# EAGLE design sgtl5000_breakout_board (EAGLE 9.6.2)
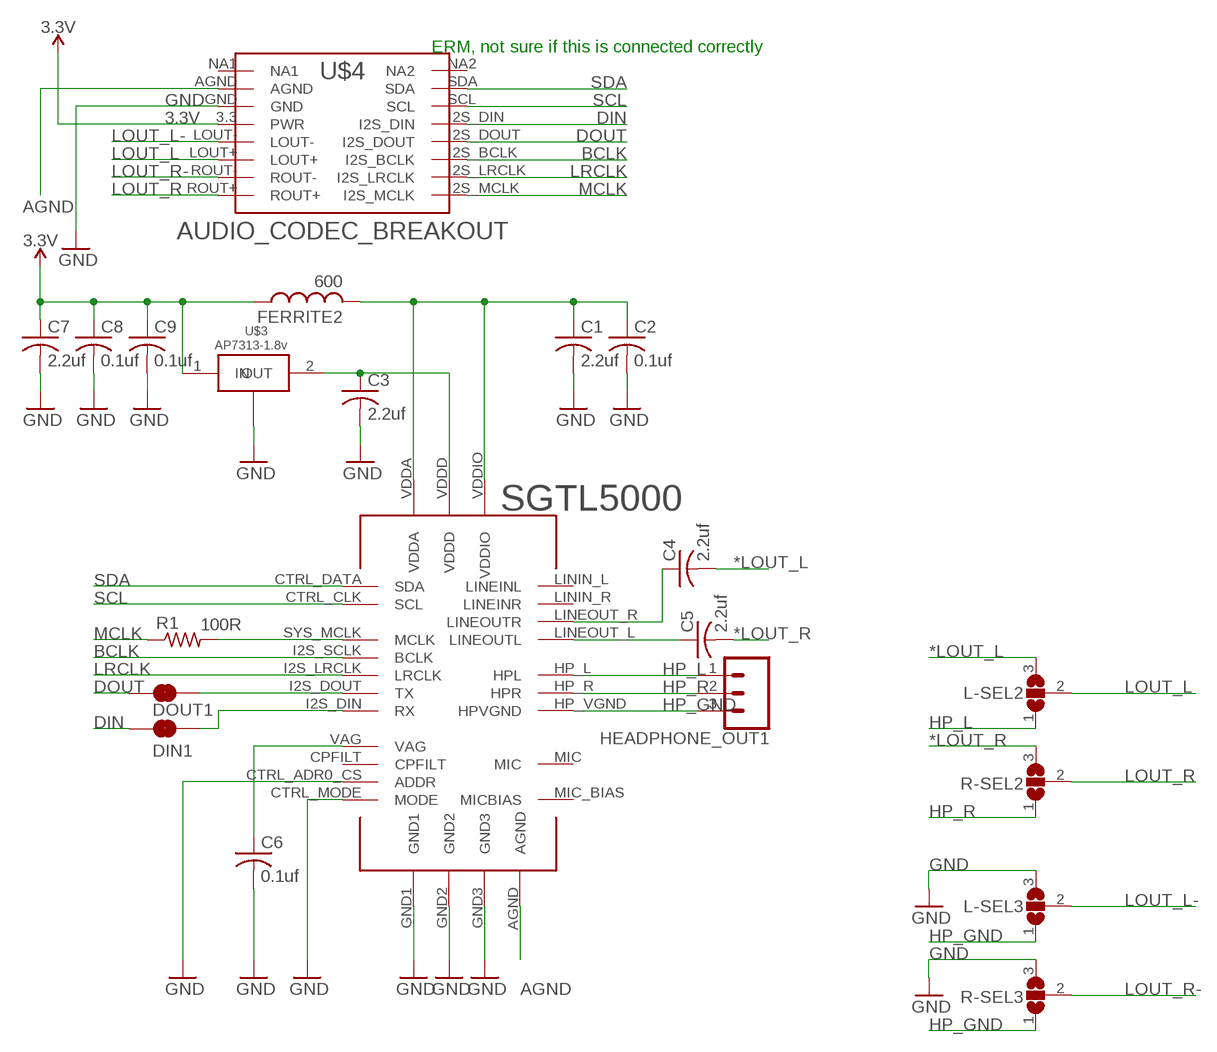
[diagram p0: schematic, sheet 1]

## Parts
C1  2.2uf  C-USC0805  [C0805]
C2  0.1uf  C-USC0805  [C0805]
C3  2.2uf  C-USC0805  [C0805]
C4  2.2uf  C-USC0805  [C0805]
C5  2.2uf  C-USC0805  [C0805]
C6  0.1uf  C-USC0805  [C0805]
C7  2.2uf  C-USC0805  [C0805]
C8  0.1uf  C-USC0805  [C0805]
C9  0.1uf  C-USC0805  [C0805]
DIN1  JUMPER-SMT_2_NC_TRACE_SILK  [SMT-JUMPER_2_NC_TRACE_SILK]
DOUT1  JUMPER-SMT_2_NC_TRACE_SILK  [SMT-JUMPER_2_NC_TRACE_SILK]
FERRITE2  600  INDUCTOR_0805_N  [RESC0805_N]
HEADPHONE_OUT1  CONN_03  [1X03]
L-SEL2  SJ2W  [SJ_2]
L-SEL3  SJ2W  [SJ_2]
R1  100R  R-US_M0805  [M0805]
R-SEL2  SJ2W  [SJ_2]
R-SEL3  SJ2W  [SJ_2]
U$2  SGTL5000  [QFN-32-5X5MM]
U$3  AP7313-1.8v  AP7313  [SOT-23]
U$4  AUDIO_CODEC_BREAKOUT  [HSS_CODEC_BREAKOUT]

## Nets
3.3V [3.3V]: C7.1 C8.1 C9.1 FERRITE2.1 U$3.1(IN) U$4.3.3(PWR)
*LOUT_L: C4.2 L-SEL2.3
*LOUT_R: C5.2 R-SEL2.3
AGND [AGND]: U$2.AGND U$4.AGND
BCLK: U$2.I2S_SCLK(BCLK) U$4.I2S_BCLK
DIN: DIN1.1 U$4.I2S_DIN
DOUT: DOUT1.1 U$4.I2S_DOUT
EDITROUTE1: C1.1 C2.1 FERRITE2.2 U$2.VDDA U$2.VDDIO
GND: C1.2 C2.2 C3.2 C6.2 C7.2 C8.2 C9.2 L-SEL3.3 R-SEL3.3 U$2.CTRL_ADR0_CS(ADDR) U$2.CTRL_MODE(MODE) U$2.GND1 U$2.GND2 U$2.GND3 U$3.3(GND) U$4.GND
HP_GND: HEADPHONE_OUT1.3 L-SEL3.1 R-SEL3.1 U$2.HP_VGND(HPVGND)
HP_L: HEADPHONE_OUT1.1 L-SEL2.1 U$2.HP_L(HPL)
HP_R: HEADPHONE_OUT1.2 R-SEL2.1 U$2.HP_R(HPR)
LOUT_L: L-SEL2.2 U$4.LOUT+
LOUT_L-: L-SEL3.2 U$4.LOUT-
LOUT_R: R-SEL2.2 U$4.ROUT+
LOUT_R-: R-SEL3.2 U$4.ROUT-
LRCLK: U$2.I2S_LRCLK(LRCLK) U$4.I2S_LRCLK
MCLK: R1.1 U$4.I2S_MCLK
N$1: C4.1 U$2.LINEOUT_R(LINEOUTR)
N$2: C5.1 U$2.LINEOUT_L(LINEOUTL)
N$3: C6.1 U$2.VAG
N$4: DIN1.2 U$2.I2S_DIN(RX)
N$5: DOUT1.2 U$2.I2S_DOUT(TX)
N$6: R1.2 U$2.SYS_MCLK(MCLK)
N$7: C3.1 U$2.VDDD U$3.2(OUT)
SCL: U$2.CTRL_CLK(SCL) U$4.SCL
SDA: U$2.CTRL_DATA(SDA) U$4.SDA
Unconnected: U$2.CPFILT U$2.LININ_L(LINEINL) U$2.LININ_R(LINEINR) U$2.MIC U$2.MIC_BIAS(MICBIAS) U$4.NA1 U$4.NA2

## Notes on the sheet
- ERM, not sure if this is connected correctly

## Library data of the parts
C1-C9 = rcl:C-US: CAPACITOR, American symbol; SPICEPREFIX: C
DIN1 DOUT1 = SparkFun-Jumpers:JUMPER-SMT_2_NC_TRACE: Normally closed trace jumper This jumper has a trace between two pads so it's normally closed (NC). Use a razor knife to open the connection. For best results follow the IPC guidelines for cutting traces: Cutout at least 0.063 mm (0.005 in). Remove all loose material to clean up the cut area. Seal the cut with an approved epoxy. Reapply solder to reclose the connection.
FERRITE2 = Nordic_nRF:INDUCTOR: Generic chip inductor
HEADPHONE_OUT1 = SparkFun-Connectors:CONN_03: Multi connection point. Often used as Generic Header-pin footprint for 0.1 inch spaced/style header connections On any of the 0.1 inch spaced packages, you can populate with these: Break Away Headers - Straight <https://www.sparkfun.com/products/116> (PRT-00116) Break Away Male Headers - Right Angle <https://www.sparkfun.com/products/553> (PRT-00553) Female Headers <https://www.sparkfun.com/products/115> (PRT-00115) Break Away Headers - Machine Pin <https://www.sparkfun.com/products/117> (PRT-00117) Break Away Female Headers - Swiss Machine Pin <https://www.sparkfun.com/products/743> (PRT-00743) Stackable Header - 3 Pin (Female, 0.1") <https://www.sparkfun.com/products/13875> (PRT-13875) For SCREWTERMINALS and SPRING TERMINALS visit here: Screw Terimnals on SparkFun.com <https://www.sparkfun.com/search/results?term=Screw+Terminals> (5mm/3.5mm/2.54mm spacing) This device is also useful as a general connection point to wire up your design to another part of your project. Our various solder wires solder well into these plated through hole pads. Hook-Up Wire - Assortment (Stranded, 22 AWG) <https://www.sparkfun.com/products/11375> (PRT-11375) Hook-Up Wire - Assortment (Solid Core, 22 AWG) <https://www.sparkfun.com/products/11367> (PRT-11367) View the entire wire category on our website here <https://www.sparkfun.com/categories/141> Special notes: Molex polarized connector foot print use with SKU : PRT-08232 with associated crimp pins and housings.
L-SEL2 L-SEL3 R-SEL2 R-SEL3 = jumper:SJ2W: SMD solder JUMPER
R1 = rcl:R-US_: RESISTOR, American symbol; SPICEPREFIX: R
U$2 = sgtl5000:SGTL5000
U$3 = AP7313:AP7313
U$4 = nathans-custom-parts:AUDIO_CODEC_BREAKOUT

## Net classes
0 default: width 0.203 mm, drill 0.254 mm, clearance 0.203 mm
2 3.3V: width 0.203 mm, drill 0.508 mm, clearance 0.254 mm
4 AGND: width 0.203 mm, drill 0.203 mm, clearance 0.203 mm

## Board
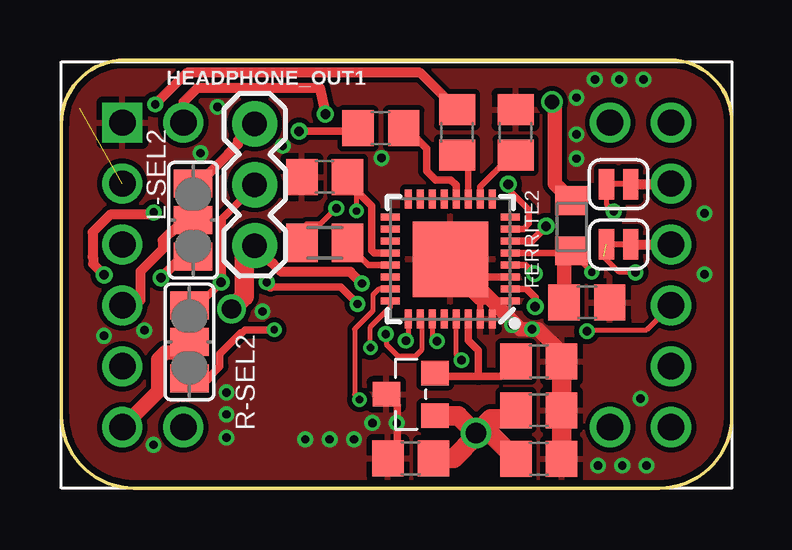
[diagram p1: board, top side]
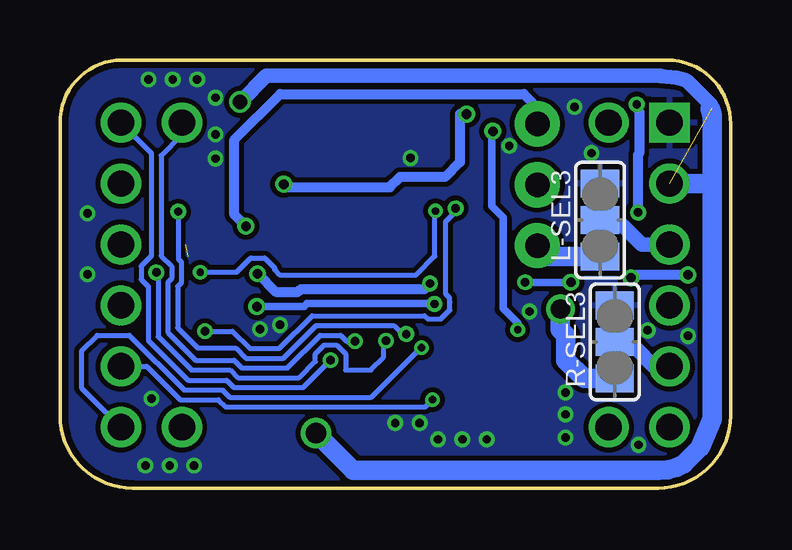
[diagram p2: board, bottom side, seen from below]

Size 27.94 x 17.86 mm. Coordinates in mm from the lower left corner, seen from the top.
Outline: 2.63,17.86 25.35,17.86 arc-90 27.94,15.24 27.94,3.02 arc-90 24.92,0 3.02,0 arc-90 0,3.02 0,15.18 arc-90 2.63,17.86
Copper layers (1*16): Top 0.035mm / dielectric 1.5mm / Bottom 0.035mm
Design rules "SeeedStudio_2layer_DRU_no_angle_20140221": minimum track width 6mil, minimum drill 12mil, track to track 6mil, track to pad 6mil, pad to pad 6mil, via to via 6mil, smd to smd 0mil, copper to edge 10mil, drill to drill 10mil, minimum pad ring 10mil, minimum via ring 6mil, stop-mask expansion 2mil, vias tented up to drill 100mil, thermal gap 10mil

### Footprints (pad centres in the part's own frame; a part is rotated, then mirrored left to right if it is on the bottom)
C0805 = smd 1.3 x 1.5: 1 -0.95,0; 2 0.95,0
SMT-JUMPER_2_NC_TRACE_SILK = smd 0.635 x 1.27: 1 -0.508,0; 2 0.508,0
RESC0805_N = smd 1.2 x 1.35: 1 -1.1,0; 2 1,0
1X03 = drill 1.016 pad 1.88: 1 0,0; 2 2.54,0; 3 5.08,0
SJ_2 = smd 1.168 x 1.6: 1 -1.524,0; 2 0,0; 3 1.524,0
M0805 = smd 1.3 x 1.6: 1 -0.95,0; 2 0.95,0
QFN-32-5X5MM = smd 0.285 x 0.8: 8 1.75,-2.5; 17 1.75,2.5; 19 0.75,2.5; 22 -0.75,2.5; AGND 1.25,-2.5; CPFILT 1.25,2.5; GND2 -1.75,-2.5; GND3 -0.75,-2.5; HP_L 0.75,-2.5; HP_R -1.25,-2.5; HP_VGND -0.25,-2.5; I2S_LRCLK -1.25,2.5; I2S_SCLK -1.75,2.5; SYS_MCLK -0.25,2.5; VDDA 0.25,-2.5; VDDIO 0.25,2.5 | smd 0.8 x 0.285: 9 2.5,-1.75; 28 -2.5,0.25; CTRL_ADR0_CS -2.5,-1.25; CTRL_CLK -2.5,-0.25; CTRL_DATA -2.5,0.75; CTRL_MODE -2.5,-1.75; I2S_DIN -2.5,1.25; I2S_DOUT -2.5,1.75; LINEOUT_L 2.5,-0.25; LINEOUT_R 2.5,-0.75; LININ_L 2.5,0.75; LININ_R 2.5,0.25; MIC 2.5,1.25; MIC_BIAS 2.5,1.75; VAG 2.5,-1.25; VDDD -2.5,-0.75 | smd 3.15 x 3.15: GND1 0,0
SOT-23 = smd 1.016 x 1.143: 1 -0.889,-1.016; 2 0.889,-1.016; 3 0,1.016
HSS_CODEC_BREAKOUT = drill 1.1 pad 1.676: 3.3 -11.43,3.81; AGND -8.89,6.35; I2S_BCLK 11.43,-6.35; I2S_DIN 11.43,3.81; I2S_DOUT 11.43,1.27; I2S_LRCLK 11.43,-3.81; I2S_MCLK 11.43,-1.27; LOUT+ -11.43,-1.27; LOUT- -11.43,1.27; NA1 -8.89,-6.35; NA2 8.89,-6.35; ROUT+ -11.43,-6.35; ROUT- -11.43,-3.81; SCL 11.43,6.35; SDA 8.89,6.35 | drill 1.1 pad 1.676 square: GND -11.43,6.35

### Placement (x,y rotation side)
C1  21.89,7.75 0 top
C2  10.97,12.98 180 top
C3  19.89,5.28 0 top
C4  16.48,14.83 90 top
C5  13.31,15.01 180 top
C6  18.92,14.83 90 top
C7  19.89,3.25 0 top
C8  14.55,1.24 180 top
C9  19.89,1.22 0 top
DIN1  23.22,12.67 180 top
DOUT1  23.22,10.16 180 top
FERRITE2  21.26,10.9 270 top
HEADPHONE_OUT1  8.05,15.19 270 top
L-SEL2  5.49,11.18 270 top
L-SEL3  5.44,11.18 90 bottom
R1  10.97,10.24 0 top
R-SEL2  5.33,6.1 270 top
R-SEL3  4.83,6.1 90 bottom
U$2  16.21,9.55 90 top
U$3  14.55,3.91 90 top
U$4  13.97,8.89 0 top

### Tracks (layer width: path | path; a pad name or v marks a point on that pad's centre or on a via)
3.3V  (via drill 0.6, 0.85)  (1 unrouted)
  Top 0.61: FERRITE2.1 20.56,12.69 20.56,15.98 v20.44,16.1
  Top 0.813: v17.27,2.29 17.88,2.9 18.85,2.9 18.85,3.16 C7.1 | v17.27,2.29 17.27,2.17 16.34,1.25 C8.1 | v17.27,2.29 17.87,2.29 C9.1 | U$3.1 16.54,3.02 v17.27,2.29
  Bottom 0.61: v20.44,16.1 19.34,17.2 2.94,17.2 2.92,17.17 | 0.75,15.85 0.81,15.98 1.8,16.97 1.93,17.03 2.09,17.07 2.26,17.11 2.92,17.17 | 2.92,17.17
  Bottom 0.813: 0.76,12.72 0.76,2.89 1.26,1.7 1.95,1.01 2.24,0.87 2.62,0.77 3.02,0.74 15.72,0.74 v17.27,2.29 | 0.82,15.78 0.84,15.79 0.84,15.82 0.82,15.78 | 0.82,15.78 0.76,15.52 0.76,12.72 | 0.82,15.78 0.76,15.48 0.75,15.43 0.75,12.74 0.76,12.72 | U$4.3.3 0.79,12.7 0.76,12.72
*LOUT_L  (via drill 0.35, 0.4)
  Top 0.406: v3.91,16 5.23,17.32 14.95,17.32 C4.2 | v3.85,11.49 3.76,11.4 2.02,11.4 1.29,10.68 1.29,9.64 1.32,9.62 1.32,9.35 v1.78,8.89 | v4.15,8.77 5.03,9.65 L-SEL2.3
  Bottom 0.406: v3.91,16 3.91,15.83 3.81,15.73 3.81,13.95 3.85,13.91 v3.85,11.49 | v1.78,8.89 4.03,8.89 v4.15,8.77
*LOUT_R  (via drill 0.3, 0.4)
  Top 0.305: 6.1,4.57 6.6,5.08 6.6,5.59 7.48,6.46 7.51,6.46 7.65,6.6 v8.87,6.6 | v9.91,14.88 12.36,14.88
  Top 0.406: R-SEL2.3 6.1,4.57 | v8.87,6.6 8.88,6.59 | 12.36,14.88 C5.2
  Bottom 0.305: v8.87,6.6 8.87,6.88 9.47,7.49 9.47,11.28 9.96,11.76 9.96,14.83 v9.91,14.88
AGND  (via drill 0.4)
  Top 0.279: U$2.AGND 19.26,10.8 19.48,11.02 19.48,11.61 18.62,12.47 v18.62,12.68
  Top 0.406: v11,15.6 11,15.74 10.78,16.69 5.66,16.69 5.08,16.1 U$4.AGND
  Bottom 0.406: v18.62,12.68 18.49,12.55 14.2,12.55 13.77,12.98 11.89,12.98 11.28,13.59 11.28,15.6 v11,15.6
BCLK  (via drill 0.3)
  Top 0.203: v12.87,5.86 12.85,5.88 12.85,6.69 13.71,7.55 U$2.I2S_SCLK
  Bottom 0.203: U$4.I2S_BCLK 27.05,4.19 27.05,5.72 26.4,6.37 25.04,6.37 22.77,4.09 21.17,4.09 20.86,3.79 14.97,3.79 12.9,5.86 v12.87,5.86
DIN
  Top 0.406: DIN1.1 25.4,12.68 U$4.I2S_DIN
DOUT
  Top 0.406: DOUT1.1 U$4.I2S_DOUT
EDITROUTE1  (via drill 0.3)
  Top 0.203: FERRITE2.2 21.26,9.84 v22.1,9.01 | C2.1 12.29,12.61 v12.29,11.56
  Top 0.279: U$2.VDDA 21.17,9.8
  Top 0.305: 21.17,9.8 FERRITE2.2 | U$2.VDDIO 13.04,9.8 12.94,9.91 12.94,11.76 11.92,12.78 C2.1
  Top 0.61: FERRITE2.2 20.95,9.58 C1.1
  Bottom 0.203: v22.1,9.01 20.58,9.01 19.98,9.6 19.41,9.6 19,9.19 19,9.1 18.8,8.89 13.11,8.89 12.32,9.68 12.32,11.53 v12.29,11.56
GND  (via drill 0.35)
  Top 0.279: 17.95,7.7 U$2.CTRL_MODE | U$2.CTRL_ADR0_CS 17.45,7.69
  Top 0.305: U$2.GND1 16.2,8.94 17.35,7.8 U$2.GND2 | U$3.3 14,3.45 14,1.64 C8.2 | U$2.GND3 16.95,8.8 16.94,8.81
  Top 0.61: C3.2 20.84,5.65 19.88,6.62 19.13,6.62 17.8,7.95 17.8,7.96 16.94,8.81 U$2.GND1
  Top 0.813: C9.2 C7.2 C3.2
  Bottom 0.813: R-SEL3.3 4.88,7.67
  other vias: 12.19,2.03 11.18,2.03 10.16,2.03 12.95,2.72 13.97,2.72 22.35,0.94 23.37,0.94 24.38,0.94 24.13,3.73 18.77,6.81 19.61,6.63 26.8,8.92 26.8,11.46 21.46,13.74 21.46,14.76 21.46,16.28 22.22,17.04 23.24,17.04 24.26,17.04 3.84,1.8 6.88,3.07 8.38,7.37 13.34,13.77 6.5,15.9 5.79,13.97 9.22,14.27 3.45,6.58 1.78,6.35 6.88,2.11 6.88,3.99
  pour Top: 2.6,17.78 25.34,17.78 arc-90 27.94,15.18 27.94,3.02 arc-90 24.92,0 3.02,0 arc-90 0,3.02 0,15.18 arc-90
  pour Bottom: 2.54,17.78 25.34,17.78 arc-90 27.94,15.18 27.94,2.91 arc-90 25.03,0 3.02,0 arc-90 0,3.02 0,15.24 arc-90
HP_GND  (via drill 0.35, 0.4, 0.8)
  Top 0.279: U$2.HP_VGND 19.35,9.3 v19.71,8.94
  Top 0.406: v12.52,8.53 12.04,9.02 9.16,9.02 8.81,9.37 8.79,9.37 HEADPHONE_OUT1.3
  Top 0.813: v7.09,7.47 7.62,8 7.62,9.68 HEADPHONE_OUT1.3
  Bottom 0.406: v19.71,8.94 18.95,8.19 18.02,8.19 17.9,8.3 12.75,8.3 v12.52,8.53
  Bottom 0.813: R-SEL3.1 6.1,4.57 6.86,5.33 6.86,6.38 7.09,6.61 v7.09,7.47 | HEADPHONE_OUT1.3 7.6,9.65 L-SEL3.1
HP_L  (via drill 0.4)
  Top 0.305: U$2.HP_L 19.6,10.3 v20.21,10.91 v20.19,10.92
  Top 0.406: HEADPHONE_OUT1.1 7.36,14.49 7.36,14.34 6.92,13.91 5.72,12.7 L-SEL2.1
  Bottom 0.406: v20.19,10.92 20.68,11.4 20.68,14.53 18.77,16.43 8.61,16.43 8.05,15.88 HEADPHONE_OUT1.1
HP_R  (via drill 0.35, 0.4)
  Top 0.279: U$2.HP_R 19.39,8.3
  Top 0.305: 5.69,7.62 v6.65,8.59 | v19.74,7.57 19.74,7.95 19.39,8.3 | 8.05,12.6 6.71,11.25 6.71,8.66 | v12.34,7.68 11.63,8.39 8.72,8.39
  Top 0.406: 5.69,7.62 R-SEL2.1 | HEADPHONE_OUT1.2 8.05,12.6 | v6.65,8.59 6.65,8.61 6.71,8.66 | v8.56,8.59 8.56,8.55 8.72,8.39
  Bottom 0.305: v8.56,8.59 v6.65,8.59 | v19.74,7.58 17.77,7.58 17.65,7.69 12.53,7.69
  Bottom 0.406: v19.74,7.57 v19.74,7.58 | 12.53,7.69 12.52,7.68 v12.34,7.68
LOUT_L
  Top 0.406: L-SEL2.2 5.08,11.18 4.55,10.64 4.52,10.64 4.22,10.34 4.22,9.96 3.29,9.03 3.29,7.83 3.07,7.62 U$4.LOUT+
LOUT_L-
  Bottom 0.61: U$4.LOUT- 3.71,10.16 4.47,10.92 5.18,10.92 L-SEL3.2
LOUT_R
  Top 0.61: U$4.ROUT+ 4.03,4.03 4.03,5.37 4.32,5.66 4.9,5.66 R-SEL2.2
LOUT_R-
  Bottom 0.61: U$4.ROUT- 3.2,5.08 3.94,5.82 4.55,5.82 R-SEL3.2
LRCLK  (via drill 0.3)
  Top 0.203: U$2.I2S_LRCLK 13.22,8.3 12.98,8.06 12.98,7.39 12.22,6.64 12.22,3.89 v12.43,3.69
  Bottom 0.203: U$4.I2S_LRCLK 24.33,5.08 22.94,3.69 21.34,3.69 21.03,3.38 12.73,3.38 v12.43,3.69
MCLK  (via drill 0.35)
  Top 0.203: U$4.I2S_MCLK 24.38,6.6 21.89,6.6 v21.89,6.54 | R1.1 10.02,10.83 10.21,11.02 10.79,11.02 v11.45,11.67
  Bottom 0.203: v21.89,6.54 20.75,6.54 20.02,5.82 18.8,5.82 17.44,7.18 12.74,7.18 12.6,7.04 12.08,7.04 11.7,7.43 11.7,7.75 11.71,7.76 11.71,7.94 11.87,8.11 11.87,11.12 11.45,11.54 v11.45,11.67
N$1
  Top 0.279: U$2.LINEOUT_R 16.95,13.41
  Top 0.305: 16.95,13.41 C4.1
N$2
  Top 0.305: U$2.LINEOUT_L 16.45,12.63 16.23,12.85 15.6,12.85 15.22,13.23 15.22,14.17 14.38,15.01 C5.1
N$3
  Top 0.279: U$2.VAG 17.45,12.58 18.76,13.88
  Top 0.305: C6.1 18.76,13.88
N$4  (via drill 0.35)
  Top 0.203: DIN1.2 22.71,11.84 v23.01,11.53 | v13.51,6.43 13.54,6.4 13.54,5.99 14.01,5.51 14.77,5.51 15.01,5.75 15.01,7 U$2.I2S_DIN
  Bottom 0.203: v23.01,11.53 23.01,9.55 22.89,9.43 22.89,8.56 23.04,8.41 23.04,6.68 22.2,5.84 20.62,5.84 20.19,5.41 18.64,5.41 17.27,6.78 14.04,6.78 13.63,6.38 13.56,6.38 v13.51,6.43
N$5  (via drill 0.35)  (1 unrouted)
  Top 0.203: U$2.I2S_DOUT 14.46,6.25 v14.35,6.15 | v23.93,8.99 23.25,8.99 22.61,9.64 22.61,9.65
  Bottom 0.203: v14.35,6.15 14.48,6.02 14.48,5.44 14.99,4.93 16.04,4.93 16.04,5.6 16.41,5.97 16.93,5.97 17.3,5.6 17.3,5.28 17.98,4.6 20.53,4.6 20.86,4.93 22.45,4.93 23.85,6.33 23.85,8.92 v23.93,8.99
N$6
  Top 0.279: U$2.SYS_MCLK 12.78,9.3 11.92,10.16
  Top 0.305: 11.92,10.16 R1.2
N$7
  Top 0.305: 17.37,4.65 18.31,4.65 C3.1 | 17.37,4.65 15.72,4.65 U$3.2 | U$2.VDDD 16.95,6.16 17.37,5.74 17.37,4.65
SCL  (via drill 0.35)
  Top 0.203: v16.67,5.33 16.45,5.55 U$2.CTRL_CLK
  Bottom 0.203: U$4.SCL 24.13,13.97 24.13,9.68 24.56,9.26 24.56,8.71 24.26,8.4 24.26,6.16 22.6,4.5 21,4.5 20.7,4.19 17.81,4.19 v16.67,5.33
SDA  (via drill 0.35)
  Top 0.203: v15.65,6.12 15.46,6.31 U$2.CTRL_DATA
  Bottom 0.203: U$4.SDA 22.86,14.73 23.72,13.87 23.72,9.69 23.29,9.26 23.29,8.73 23.44,8.58 23.44,6.49 22.29,5.33 20.69,5.33 20.36,5.01 18.47,5.01 17.1,6.37 16.24,6.37 15.99,6.12 v15.65,6.12